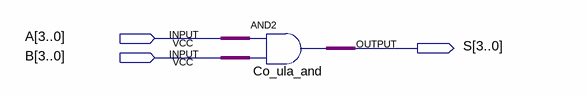
[diagram p0: schematic sheet]
// Quartus schematic and_4co.bdf as structural Verilog: 1 symbols, 3 pins
module and_4co (
  input  [3:0] A,
  input  [3:0] B,
  output [3:0] S
);

  assign S = A & B;  // AND2 Co_ula_and, 4 bits wide
endmodule
